# EAGLE design M7672n (EAGLE 4.11)
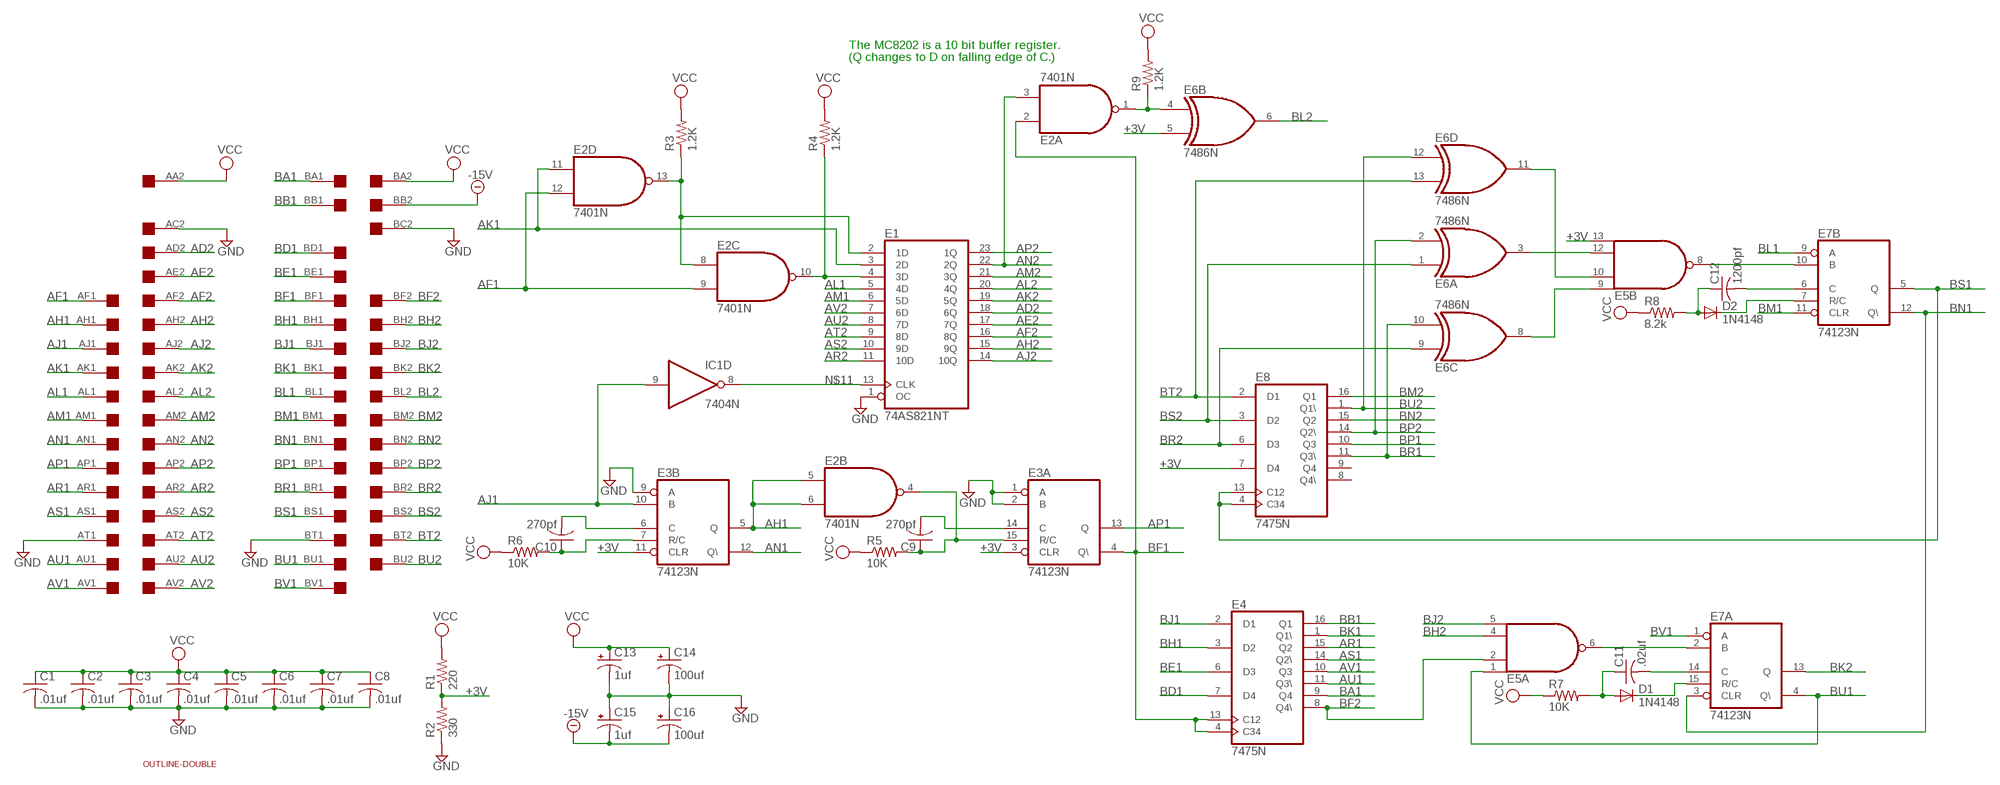
[diagram p0: schematic, sheet 1]

## Parts
C1  .01uf  C-US050-025X075  [C050-025X075]
C2  .01uf  C-US050-025X075  [C050-025X075]
C3  .01uf  C-US050-025X075  [C050-025X075]
C4  .01uf  C-US050-025X075  [C050-025X075]
C5  .01uf  C-US050-025X075  [C050-025X075]
C6  .01uf  C-US050-025X075  [C050-025X075]
C7  .01uf  C-US050-025X075  [C050-025X075]
C8  .01uf  C-US050-025X075  [C050-025X075]
C9  270pf  C-US050-025X075  [C050-025X075]
C10  270pf  C-US050-025X075  [C050-025X075]
C11  .02uf  C-US050-025X075  [C050-025X075]
C12  1200pf  C-US050-025X075  [C050-025X075]
C13  1uf  CPOL-USE30-10AXIAL  [E30-10]
C14  100uf  CPOL-USE30-10AXIAL  [E30-10]
C15  1uf  CPOL-USE30-10AXIAL  [E30-10]
C16  100uf  CPOL-USE30-10AXIAL  [E30-10]
D1  1N4148  [DO35-10]
D2  1N4148  [DO35-10]
E1  74AS821NT  [DIL24-6]
E2  7401N  [DIL14]
E3  74123N  [DIL16]
E4  7475N  [DIL16]
E5  74S20N  [DIL14]
E6  7486N  [DIL14]
E7  74123N  [DIL16]
E8  7475N  [DIL16]
EDGE  DOUBLE  [EDGE-CON4]
IC1  7404N  [DIL14]
R1  220  R-US_0207/10  [0207/10]
R2  330  R-US_0207/10  [0207/10]
R3  1.2K  R-US_0207/10  [0207/10]
R4  1.2K  R-US_0207/10  [0207/10]
R5  10K  R-US_0207/10  [0207/10]
R6  10K  R-US_0207/10  [0207/10]
R7  10K  R-US_0207/10  [0207/10]
R8  8.2k  R-US_0207/10  [0207/10]
R9  1.2K  R-US_0207/10  [0207/10]
U$2  OUTLINE-DOUBLE  [DOUBLE]

## Nets
+3V: E3.3(A:CLR) E3.11(B:CLR) E5.13(B:I3) E6.5(B:I1) E8.7(D4) R1.1 R2.2
-15V: C15.- C16.- EDGE.BB2
AD2: E1.18(6Q) EDGE.AD2
AE2: E1.17(7Q) EDGE.AE2
AF1: E2.9(C:I1) E2.12(D:I1) EDGE.AF1
AF2: E1.16(8Q) EDGE.AF2
AH1: E2.5(B:I0) E2.6(B:I1) E3.5(B:Q) EDGE.AH1
AH2: E1.15(9Q) EDGE.AH2
AJ1: E3.10(B:B) EDGE.AJ1 IC1.9(D:I)
AJ2: E1.14(10Q) EDGE.AJ2
AK1: E1.3(2D) E2.11(D:I0) EDGE.AK1
AK2: E1.19(5Q) EDGE.AK2
AL1: E1.5(4D) EDGE.AL1
AL2: E1.20(4Q) EDGE.AL2
AM1: E1.6(5D) EDGE.AM1
AM2: E1.21(3Q) EDGE.AM2
AN1: E3.12(B:Q\) EDGE.AN1
AN2: E1.22(2Q) E2.3(A:I1) EDGE.AN2
AP1: E3.13(A:Q) EDGE.AP1
AP2: E1.23(1Q) EDGE.AP2
AR1: E4.15(Q2) EDGE.AR1
AR2: E1.11(10D) EDGE.AR2
AS1: E4.14(Q2\) EDGE.AS1
AS2: E1.10(9D) EDGE.AS2
AT2: E1.9(8D) EDGE.AT2
AU1: E4.11(Q3\) EDGE.AU1
AU2: E1.8(7D) EDGE.AU2
AV1: E4.10(Q3) EDGE.AV1
AV2: E1.7(6D) EDGE.AV2
BA1: E4.9(Q4) EDGE.BA1
BB1: E4.16(Q1) EDGE.BB1
BD1: E4.7(D4) EDGE.BD1
BE1: E4.6(D3) EDGE.BE1
BF1: E2.2(A:I0) E3.4(A:Q\) E4.4(C34) E4.13(C12) EDGE.BF1
BF2: E4.8(Q4\) E5.2(A:I1) EDGE.BF2
BH1: E4.3(D2) EDGE.BH1
BH2: E5.4(A:I2) EDGE.BH2
BJ1: E4.2(D1) EDGE.BJ1
BJ2: E5.5(A:I3) EDGE.BJ2
BK1: E4.1(Q1\) EDGE.BK1
BK2: E7.13(A:Q) EDGE.BK2
BL1: E7.9(B:A) EDGE.BL1
BL2: E6.6(B:O) EDGE.BL2
BM1: E7.11(B:CLR) EDGE.BM1
BM2: E8.16(Q1) EDGE.BM2
BN1: E7.3(A:CLR) E7.12(B:Q\) EDGE.BN1
BN2: E8.15(Q2) EDGE.BN2
BP1: E8.10(Q3) EDGE.BP1
BP2: E6.2(A:I1) E8.14(Q2\) EDGE.BP2
BR1: E6.10(C:I1) E8.11(Q3\) EDGE.BR1
BR2: E6.9(C:I0) E8.6(D3) EDGE.BR2
BS1: E7.5(B:Q) E8.4(C34) E8.13(C12) EDGE.BS1
BS2: E6.1(A:I0) E8.3(D2) EDGE.BS2
BT2: E6.13(D:I1) E8.2(D1) EDGE.BT2
BU1: E5.1(A:I0) E7.4(A:Q\) EDGE.BU1
BU2: E6.12(D:I0) E8.1(Q1\) EDGE.BU2
BV1: E7.1(A:A) EDGE.BV1
GND [power]: C1.2 C2.2 C3.2 C4.2 C5.2 C6.2 C7.2 C8.2 C13.- C14.- C15.+ C16.+ E1.1(OC) E3.1(A:A) E3.2(A:B) E3.9(B:A) EDGE.AC2 EDGE.AT1 EDGE.BC2 EDGE.BT1 R2.1
N$1: E1.2(1D) E2.8(C:I0) E2.13(D:O) R3.1
N$2: E1.4(3D) E2.10(C:O) R4.1
N$3: E2.1(A:O) E6.4(B:I0) R9.1
N$4: E5.12(B:I2) E6.3(A:O)
N$5: C10.1 E3.7(B:R/C) R6.2
N$6: C10.2 E3.6(B:C)
N$7: C9.1 E2.4(B:O) E3.15(A:R/C) R5.2
N$8: C9.2 E3.14(A:C)
N$9: E5.10(B:I1) E6.11(D:O)
N$10: E5.9(B:I0) E6.8(C:O)
N$11: E1.13(CLK) IC1.8(D:O)
N$12: E5.6(A:O) E7.2(A:B)
N$13: D1.C E7.15(A:R/C)
N$14: C11.2 E7.14(A:C)
N$15: C11.1 D1.A R7.2
N$16: E5.8(B:O) E7.10(B:B)
N$17: D2.C E7.7(B:R/C)
N$18: C12.2 E7.6(B:C)
N$19: C12.1 D2.A R8.2
VCC [power]: C1.1 C2.1 C3.1 C4.1 C5.1 C6.1 C7.1 C8.1 C13.+ C14.+ EDGE.AA2 EDGE.BA2 R1.2 R3.2 R4.2 R5.1 R6.1 R7.1 R8.1 R9.2
Unconnected: E8.8(Q4\) E8.9(Q4) EDGE.AA1 EDGE.AB1 EDGE.AB2 EDGE.AC1 EDGE.AD1 EDGE.AE1 EDGE.BC1 EDGE.BD2 EDGE.BE2 EDGE.BV2 IC1.1(A:I) IC1.2(A:O) IC1.3(B:I) IC1.4(B:O) IC1.5(C:I) IC1.6(C:O) IC1.10(E:O) IC1.11(E:I) IC1.12(F:O) IC1.13(F:I)

## Notes on the sheet
- The MC8202 is a 10 bit buffer register.
- (Q changes to D on falling edge of C.)

## Power pins joined to a net without a drawn wire
GND: E1.12(GND) E2.7(P:GND) E3.8(P:GND) E4.12(GND) E5.7(P:GND) E6.7(P:GND) E7.8(P:GND) E8.12(GND) IC1.7(P:GND)
VCC: E1.24(VCC) E2.14(P:VCC) E3.16(P:VCC) E4.5(VCC) E5.14(P:VCC) E6.14(P:VCC) E7.16(P:VCC) E8.5(VCC) IC1.14(P:VCC)

## Library data of the parts
C1-C12 = rcl:C-US: CAPACITOR, American symbol
C13-C16 = rcl:CPOL-US: POLARIZED CAPACITOR, American symbol
D1 D2 = diode:1N4148: DIODE high speed (Philips)
E1 = 74xx-us:74*821: 10-bit bus interface FLIP FLOP
E2 = 74xx-jameco:74*01: Quad 2-input NAND gate, open collector
E3 E7 = 74xx-jameco:74*123: Retriggerable monostable MULTIVIBRATOR
E4 E8 = 74xx-jameco:74*75: 4-bit bistable LATCH
E5 = 74xx-jameco:74*20: Dual 4-input NAND gate
E6 = 74xx-jameco:74*86: Quad 2-input EXCLUSIV-OR (XOR) gate
EDGE = dec-con:DOUBLE: Double-Height DEC board
IC1 = 74xx-jameco:74*04: Hex INVERTER
R1-R9 = rcl:R-US_: RESISTOR, American symbol
U$2 = dec-con:OUTLINE-*: Board outlines for DEC boards.

## Net classes
1 power: width 0.508 mm

## Board
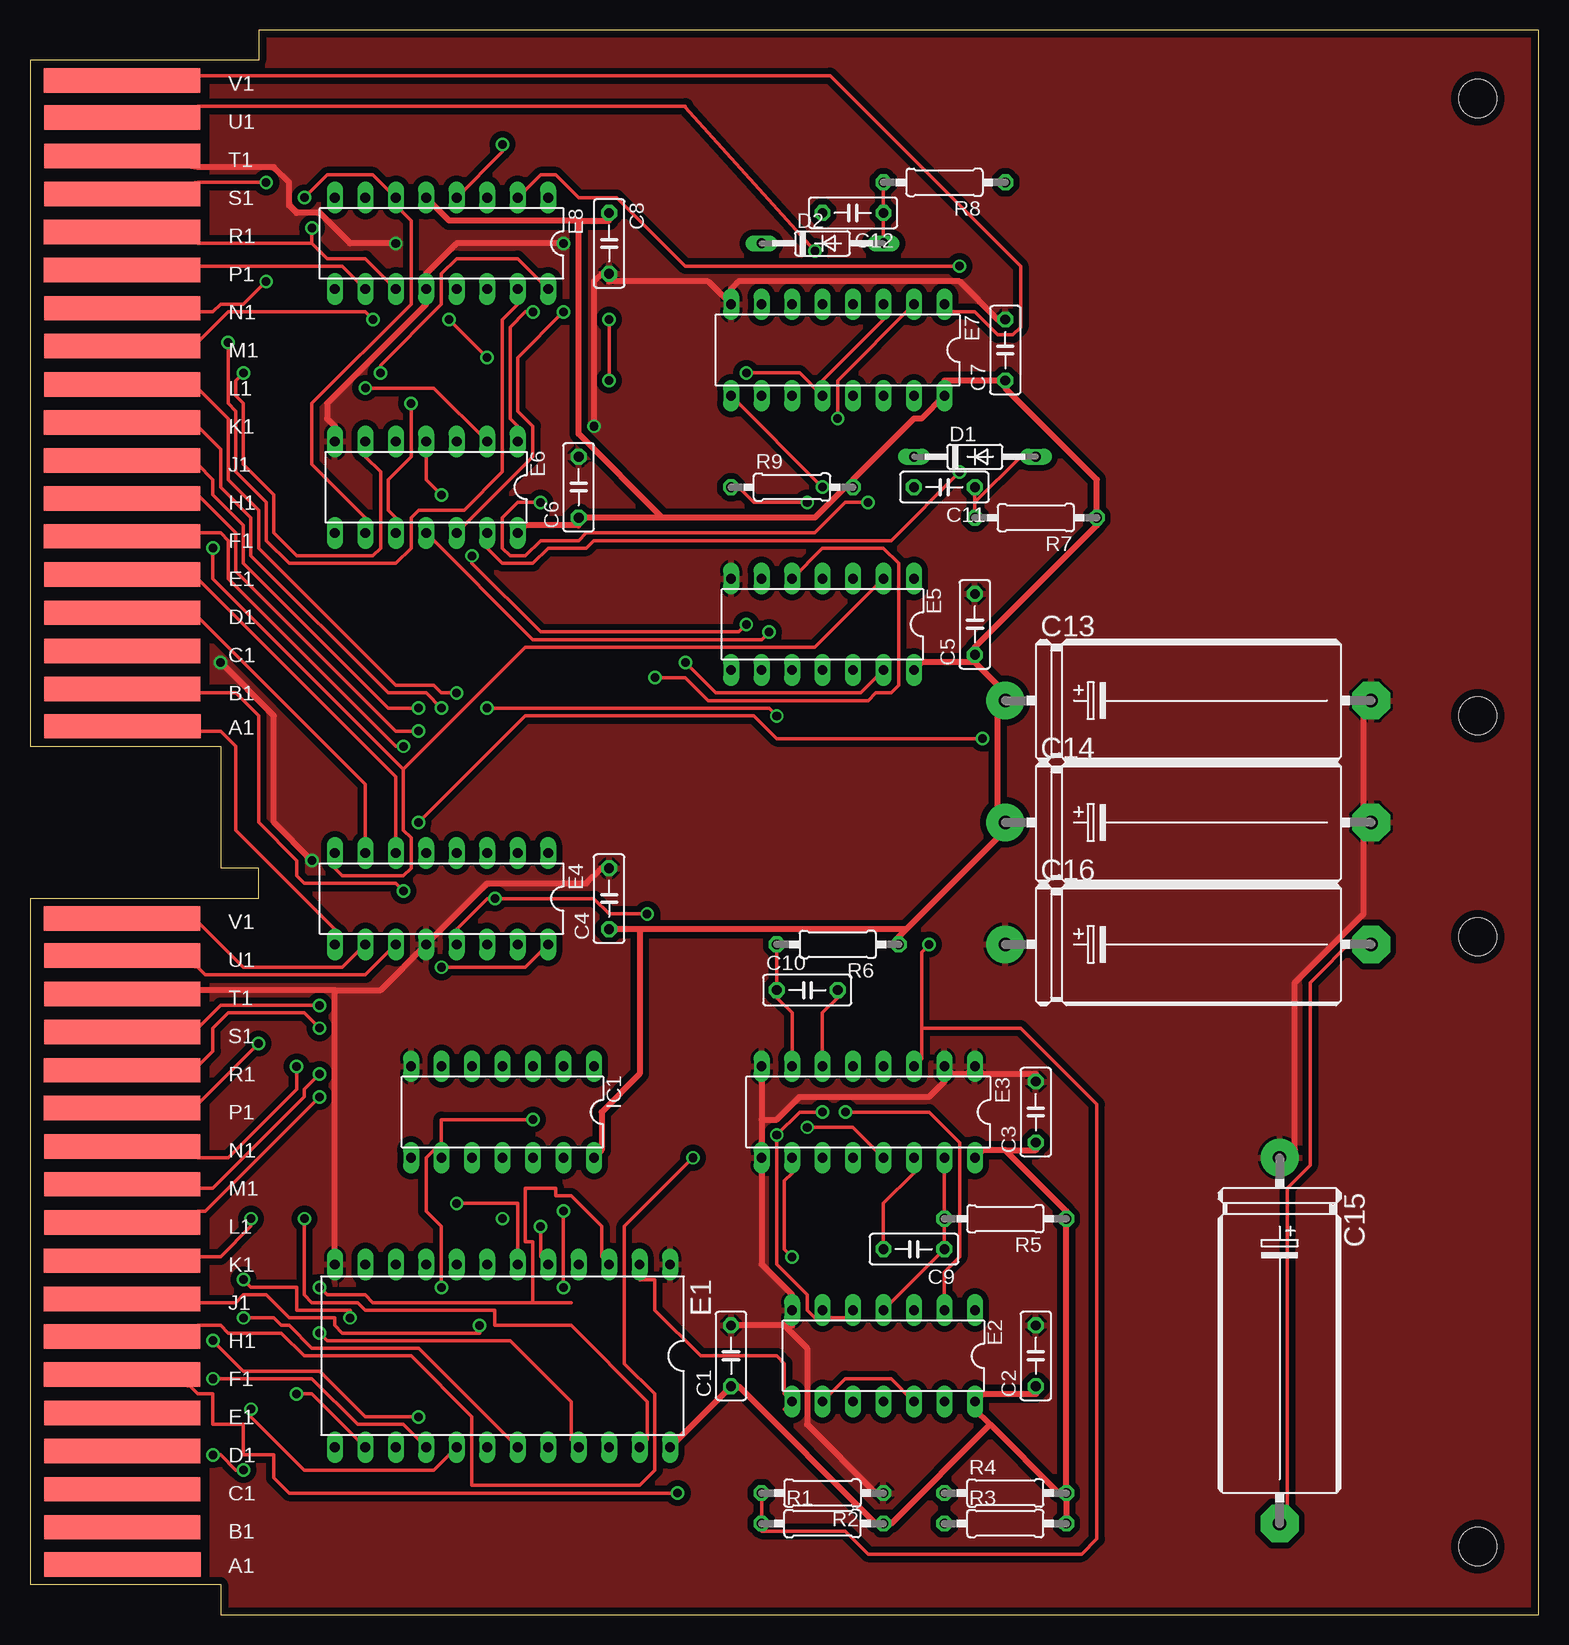
[diagram p1: board, top side]
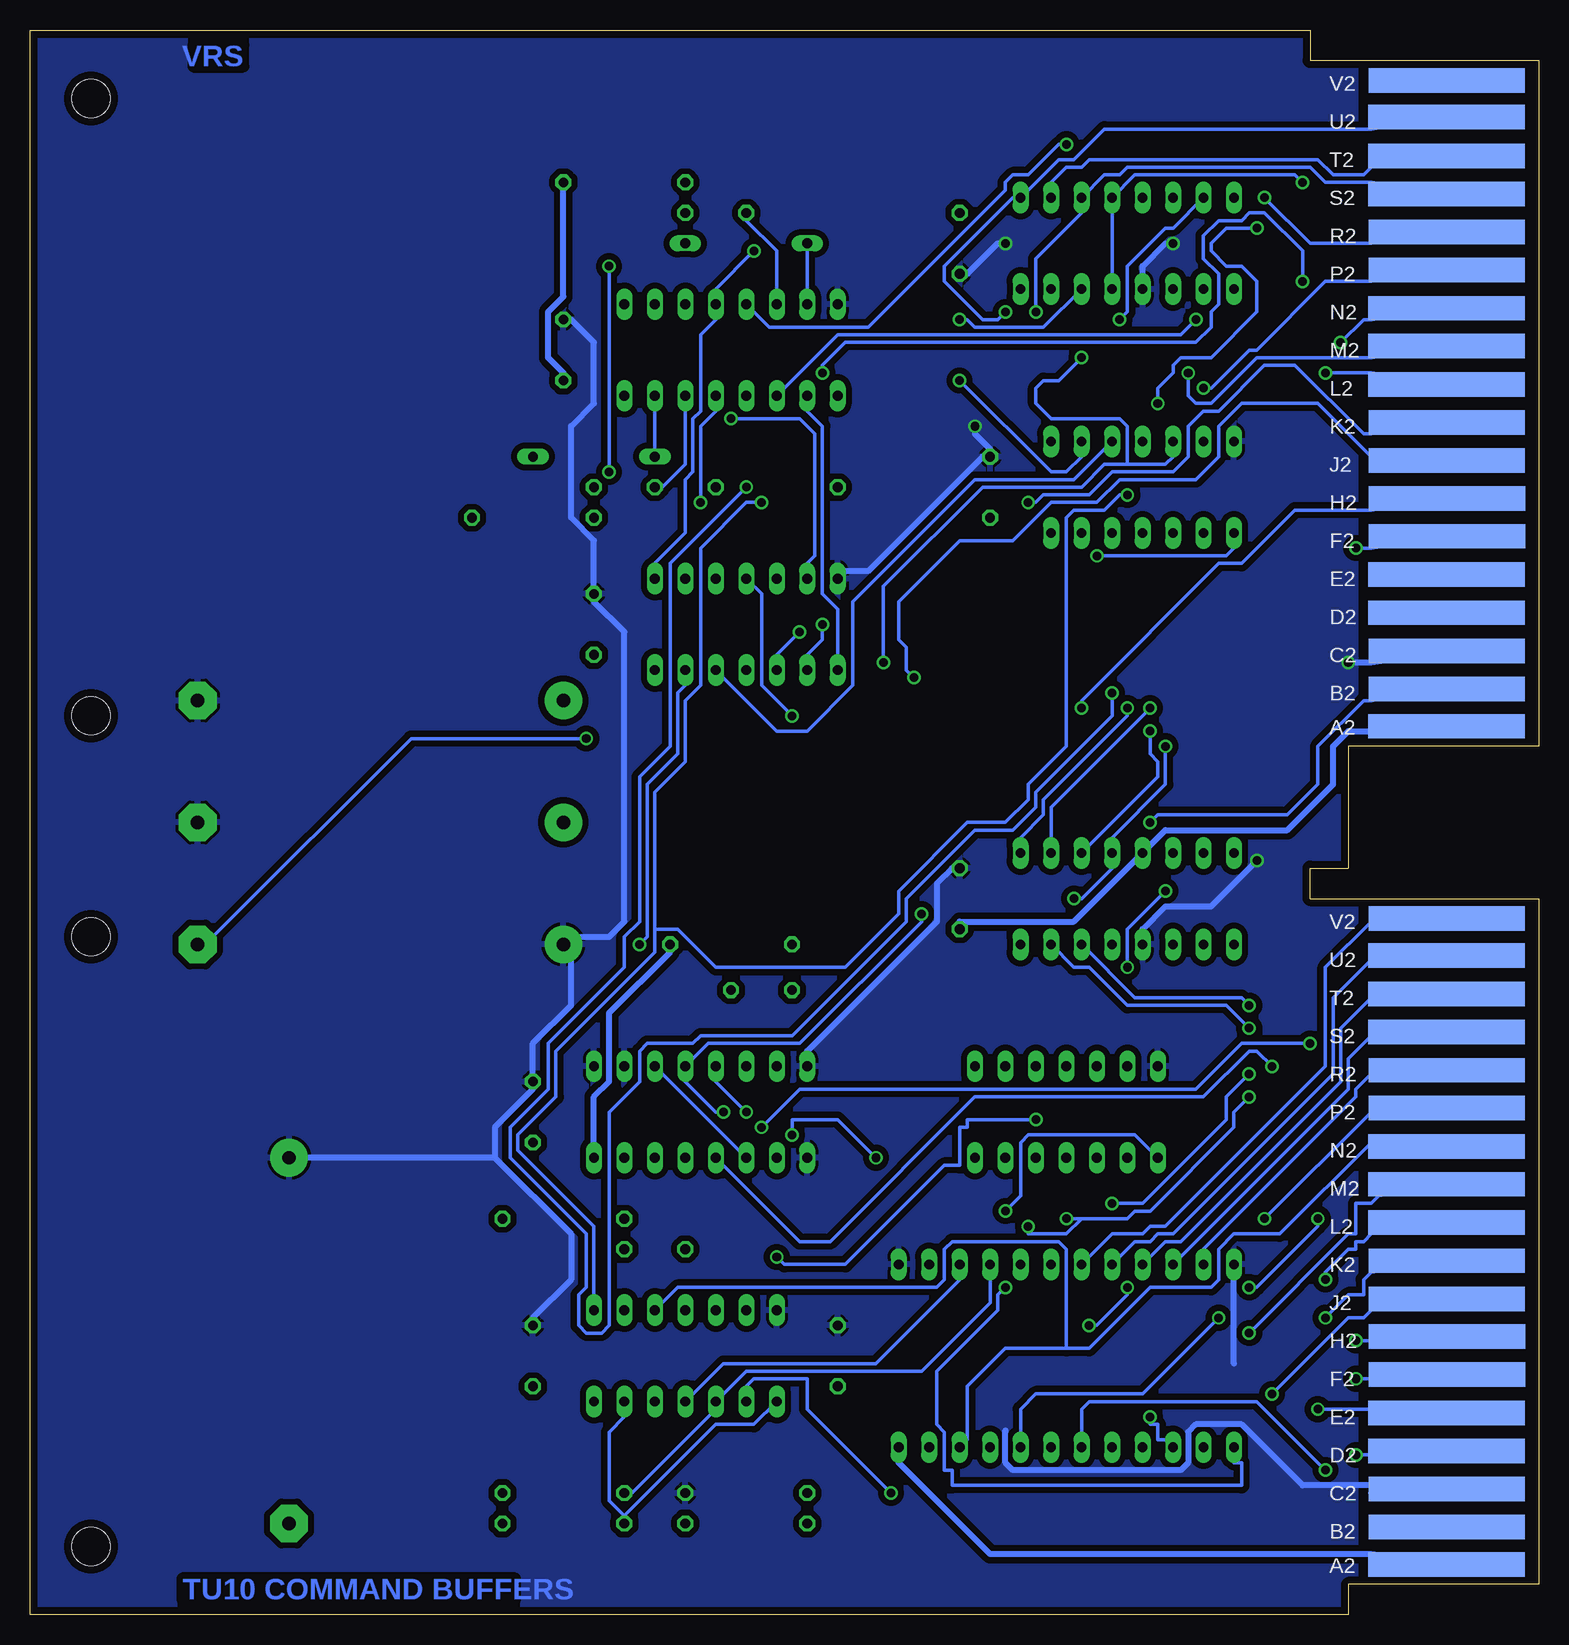
[diagram p2: board, bottom side, seen from below]

Size 125.73 x 132.08 mm. Coordinates in mm from the lower left corner, seen from the top.
Copper layers (1*16): Top 0.035mm / dielectric 1.5mm / Bottom 0.035mm
Design rules "10mils": minimum track width 12mil, minimum drill 28mil, track to track 10mil, track to pad 10mil, pad to pad 10mil, via to via 10mil, smd to smd 10mil, copper to edge 25mil, drill to drill 10mil, minimum pad ring 10mil, minimum via ring 8mil, stop-mask expansion 0mil, vias tented up to drill 0mil, thermal gap 10mil

### Footprints (pad centres in the part's own frame; a part is rotated, then mirrored left to right if it is on the bottom)
C050-025X075 = drill 0.813 octagon: 1 -2.54,0; 2 2.54,0
E30-10 = drill 1.118 pad 3.15 round: + -15.24,0 | drill 1.118 pad 3.15 octagon: - 15.24,0
DO35-10 = drill 0.813 long: A 5.08,0; C -5.08,0
DIL24-6 = drill 0.813 long: 1 -13.97,-7.62; 2 -11.43,-7.62; 3 -8.89,-7.62; 4 -6.35,-7.62; 5 -3.81,-7.62; 6 -1.27,-7.62; 7 1.27,-7.62; 8 3.81,-7.62; 9 6.35,-7.62; 10 8.89,-7.62; 11 11.43,-7.62; 12 13.97,-7.62; 13 13.97,7.62; 14 11.43,7.62; 15 8.89,7.62; 16 6.35,7.62; 17 3.81,7.62; 18 1.27,7.62; 19 -1.27,7.62; 20 -3.81,7.62; 21 -6.35,7.62; 22 -8.89,7.62; 23 -11.43,7.62; 24 -13.97,7.62
DIL14 = drill 0.813 long: 1 -7.62,-3.81; 2 -5.08,-3.81; 3 -2.54,-3.81; 4 0,-3.81; 5 2.54,-3.81; 6 5.08,-3.81; 7 7.62,-3.81; 8 7.62,3.81; 9 5.08,3.81; 10 2.54,3.81; 11 0,3.81; 12 -2.54,3.81; 13 -5.08,3.81; 14 -7.62,3.81
DIL16 = drill 0.813 long: 1 -8.89,-3.81; 2 -6.35,-3.81; 3 -3.81,-3.81; 4 -1.27,-3.81; 5 1.27,-3.81; 6 3.81,-3.81; 7 6.35,-3.81; 8 8.89,-3.81; 9 8.89,3.81; 10 6.35,3.81; 11 3.81,3.81; 12 1.27,3.81; 13 -1.27,3.81; 14 -3.81,3.81; 15 -6.35,3.81; 16 -8.89,3.81
EDGE-CON4 = smd 13.017 x 2.032: AA1 7.709,4.207; AB1 7.684,7.312; AC1 7.684,10.474; AD1 7.684,13.665; AE1 7.693,16.84; AF1 7.668,20.041; AH1 7.668,23.19; AJ1 7.668,26.34; AK1 7.668,29.515; AL1 7.693,32.69; AM1 7.693,35.89; AN1 7.693,39.04; AP1 7.668,42.24; AR1 7.668,45.39; AS1 7.693,48.565; AT1 7.693,51.74; AU1 7.693,54.94; AV1 7.668,58.026; BA1 7.709,74.057; BB1 7.684,77.162; BC1 7.684,80.324; BD1 7.684,83.515; BE1 7.693,86.69; BF1 7.668,89.891; BH1 7.668,93.04; BJ1 7.668,96.19; BK1 7.668,99.365; BL1 7.693,102.54; BM1 7.693,105.74; BN1 7.693,108.89; BP1 7.668,112.09; BR1 7.668,115.24; BS1 7.693,118.415; BT1 7.693,121.59; BU1 7.693,124.79; BV1 7.668,127.876 | smd 13.017 x 2.032 bottom: AA2 7.69,4.207; AB2 7.668,7.328; AC2 7.668,10.49; AD2 7.693,13.665; AE2 7.693,16.84; AF2 7.642,20.041; AH2 7.642,23.19; AJ2 7.668,26.34; AK2 7.668,29.515; AL2 7.693,32.69; AM2 7.693,35.89; AN2 7.693,39.04; AP2 7.668,42.24; AR2 7.668,45.39; AS2 7.693,48.565; AT2 7.693,51.74; AU2 7.693,54.966; AV2 7.668,58.026; BA2 7.69,74.057; BB2 7.668,77.178; BC2 7.668,80.34; BD2 7.693,83.515; BE2 7.693,86.69; BF2 7.642,89.891; BH2 7.642,93.04; BJ2 7.668,96.19; BK2 7.668,99.365; BL2 7.693,102.54; BM2 7.693,105.74; BN2 7.693,108.89; BP2 7.668,112.09; BR2 7.668,115.24; BS2 7.693,118.415; BT2 7.693,121.59; BU2 7.693,124.816; BV2 7.668,127.876
0207/10 = drill 0.813 octagon: 1 -5.08,0; 2 5.08,0
DOUBLE = hole 3.175: 120.65,56.515; 120.65,5.715; 120.65,74.93; 120.65,126.365

### Placement (x,y rotation side)
C1  58.42,21.59 90 top
C2  83.82,21.59 90 top
C3  83.82,41.91 90 top
C4  48.26,59.69 90 top
C5  78.74,82.55 90 top
C6  45.72,93.98 90 top
C7  81.28,105.41 90 top
C8  48.26,114.3 270 top
C9  73.66,30.48 180 top
C10  64.77,52.07 0 top
C11  76.2,93.98 180 top
C12  68.58,116.84 180 top
C13  96.52,76.2 0 top
C14  96.52,66.04 0 top
C15  104.14,22.86 270 top
C16  96.52,55.88 0 top
D1  78.74,96.52 0 top
D2  66.04,114.3 0 top
E1  39.37,21.59 180 top
E2  71.12,21.59 180 top
E3  69.85,41.91 180 top
E4  34.29,59.69 180 top
E5  66.04,82.55 180 top
E6  33.02,93.98 180 top
E7  67.31,105.41 180 top
E8  34.29,114.3 180 top
EDGE  0,0 0 top
IC1  39.37,41.91 180 top
R1  66.04,7.62 0 top
R2  66.04,10.16 180 top
R3  81.28,7.62 0 top
R4  81.28,10.16 0 top
R5  81.28,33.02 180 top
R6  67.31,55.88 180 top
R7  83.82,91.44 180 top
R8  76.2,119.38 180 top
R9  63.5,93.98 0 top
U$2  0,0 0 top

### Tracks (layer width: path | path; a pad name or v marks a point on that pad's centre or on a via)
+3V  (via drill 0.71)
  Top 0.305: R2.2 R1.1 60.96,6.99 67.95,6.99 69.85,5.08 87.63,5.08 88.9,6.35 88.9,42.55 82.55,48.9 74.3,48.9 | v74.93,55.88 74.3,55.24 74.3,48.9 | 74.3,48.9 74.3,46.35 E3.3 | v54.61,79.38 57.15,76.83 69.22,76.83 E5.13 | v38.1,104.78 v34.93,107.95
  Bottom 0.305: E3.3 E3.11 | v74.93,55.88 74.3,56.52 74.3,69.22 71.76,71.75 71.76,76.83 71.12,77.47 E5.13 | 34.29,95.89 36.2,95.89 38.1,93.98 46.36,93.98 54.61,85.72 v54.61,79.38 | 34.29,95.89 31.12,95.89 30.48,96.52 E6.5 | v34.93,107.95 34.29,108.58 34.29,112.39 31.12,115.57 30.48,115.57 E8.7 | v38.1,104.78 40.01,102.87 41.28,102.87 41.91,102.23 41.91,100.97 40.64,99.69 34.93,99.69 34.29,99.06 34.29,95.89
-15V  (via drill 0.71)
  Top 0.305: C15.- 104.78,8.89 104.78,35.56 106.68,37.47 106.68,52.7 110.49,56.52 C16.- | v32.39,66.04 41.28,74.93 60.33,74.93 62.23,73.03 v79.38,73.03
  Bottom 0.305: v32.39,66.04 31.75,66.67 20.96,66.67 18.42,69.22 18.42,72.39 14.61,76.2 13.97,76.2 EDGE.BB2 | v79.38,73.03 93.98,73.03 110.49,56.52 C16.-
AD2  (via drill 0.71)
  Top 0.305: v15.24,13.34 15.88,13.34 17.15,12.06 v17.78,12.06
  Bottom 0.305: v15.24,13.34 13.97,13.34 EDGE.AD2 | v17.78,12.06 23.5,17.78 37.47,17.78 38.1,17.14 E1.18
AE2  (via drill 0.71)
  Top 0.305: v18.42,17.14 18.42,16.51 22.86,12.06 33.66,12.06 E1.17
  Bottom 0.305: v18.42,17.14 13.97,17.14 EDGE.AE2
AF1  (via drill 0.71)
  Top 0.305: E2.9 67.95,19.68 71.76,19.68 E2.12 | v53.98,10.16 21.59,10.16 20.32,11.43 20.32,13.34 17.78,13.34 17.78,15.88 15.24,15.88 15.24,18.41 13.97,18.41 13.34,19.05 EDGE.AF1
  Bottom 0.305: v53.98,10.16 60.96,17.14 60.96,19.68 65.41,19.68 66.04,19.05 E2.9
AF2  (via drill 0.71)
  Top 0.305: E1.16 31.12,15.88 27.31,15.88 23.5,19.68 v15.24,19.68
  Bottom 0.305: v15.24,19.68 13.97,19.68 EDGE.AF2
AH1  (via drill 0.71)
  Top 0.305: E2.5 67.95,24.77 66.68,24.77 E2.6 65.41,24.77 64.77,25.4 64.77,26.67 62.23,29.21 v62.23,40.01 64.14,41.91 v66.04,41.91 | v55.25,38.1 49.53,32.38 49.53,20.95 52.07,18.41 52.07,12.06 50.8,10.79 36.83,10.79 36.83,16.51 31.75,21.59 22.86,21.59 20.96,23.5 16.51,23.5 15.88,24.13 13.97,24.13 EDGE.AH1
  Bottom 0.305: v66.04,41.91 68.58,44.45 E3.5 | v62.23,40.01 62.23,41.27 58.42,41.27 v55.25,38.1
AH2  (via drill 0.71)
  Top 0.305: v32.39,16.51 27.94,16.51 24.13,20.32 17.78,20.32 v15.24,22.86
  Bottom 0.305: v32.39,16.51 32.39,15.88 31.75,15.88 31.75,14.61 31.12,14.61 E1.15 | v15.24,22.86 13.97,22.86 EDGE.AH2
AJ1  (via drill 0.71)
  Top 0.305: v37.47,24.13 37.47,23.5 26.04,23.5 25.4,24.13 25.4,24.77 21.59,24.77 19.69,26.67 17.78,26.67 17.15,26.04 13.97,26.04 EDGE.AJ1 | v34.29,27.3 34.29,32.38 33.02,33.66 33.02,38.1 33.66,38.73 IC1.9 34.29,41.27 v41.91,41.27 | v63.5,29.84 62.87,30.48 62.87,36.2 63.5,36.83 E3.10
  Bottom 0.305: v37.47,24.13 36.83,24.13 34.29,26.67 v34.29,27.3 | v63.5,29.84 62.87,29.21 57.79,29.21 49.53,37.47 48.26,37.47 48.26,40.64 47.63,40.64 47.63,41.27 v41.91,41.27
AJ2  (via drill 0.71)
  Top 0.305: v22.23,18.41 23.5,18.41 E1.14
  Bottom 0.305: v22.23,18.41 15.88,24.77 14.61,24.77 13.97,25.4 EDGE.AJ2
AK1  (via drill 0.71)
  Top 0.305: v18.42,33.02 18.42,32.38 15.88,29.84 13.97,29.84 EDGE.AK1 | v24.13,27.3 24.77,26.67 27.94,26.67 28.58,26.04 41.91,26.04 | 41.91,26.04 45.09,26.04 | 41.91,26.04 41.91,31.11 41.28,31.11 41.28,35.56 43.82,35.56 43.82,34.92 45.09,34.92 47.63,32.38 47.63,29.84 E1.3
  Bottom 0.305: v18.42,33.02 18.42,32.38 23.5,27.3 v24.13,27.3 | E2.11 67.95,20.95 55.25,20.95 48.26,27.94 E1.3
AK2  (via drill 0.71)
  Top 0.305: v17.78,24.77 20.32,24.77 20.96,24.13 21.59,24.13 23.5,22.23 32.39,22.23 E1.19
  Bottom 0.305: v17.78,24.77 15.88,26.67 14.61,26.67 14.61,27.94 13.97,28.57 EDGE.AK2
AL1  (via drill 0.71)
  Top 0.305: v24.13,43.18 14.61,33.66 13.97,33.66 EDGE.AL1 | v42.55,32.38 42.55,29.84 E1.5
  Bottom 0.305: v24.13,43.18 25.4,41.91 25.4,40.64 32.39,33.66 33.66,33.66 34.29,33.02 38.1,33.02 | 38.1,33.02 v39.37,33.02 | v42.55,32.38 42.55,31.75 39.37,31.75 38.1,33.02
AL2  (via drill 0.71)
  Top 0.305: v17.78,27.94 18.42,27.3 22.23,27.3 22.23,25.4 26.67,25.4 v26.67,24.77
  Bottom 0.305: v17.78,27.94 17.78,28.57 15.88,30.48 15.24,30.48 15.24,31.11 14.61,31.11 13.97,31.75 EDGE.AL2 | v26.67,24.77 33.02,18.41 41.91,18.41 43.18,17.14 E1.20
AM1  (via drill 0.71)
  Top 0.305: v24.13,45.09 22.86,43.81 22.86,43.18 15.24,35.56 13.97,35.56 EDGE.AM1 | v35.56,34.29 40.64,34.29 E1.6
  Bottom 0.305: v24.13,45.09 26.04,43.18 26.04,41.27 33.02,34.29 v35.56,34.29
AM2  (via drill 0.71)
  Top 0.305: v24.13,23.5 24.77,22.86 40.01,22.86 45.09,17.78 45.09,14.61 E1.21
  Bottom 0.305: v24.13,23.5 15.88,31.75 15.24,31.75 15.24,34.29 13.97,34.29 13.34,34.92 EDGE.AM2
AN1  (via drill 0.71)
  Top 0.305: v22.23,45.72 22.23,43.81 16.51,38.1 13.97,38.1 EDGE.AN1
  Bottom 0.305: v22.23,45.72 23.5,46.99 24.13,46.99 27.94,43.18 46.99,43.18 59.06,31.11 61.6,31.11 E3.12
AN2
  Bottom 0.305: EDGE.AN2 13.97,39.37 21.59,31.75 25.4,31.75 26.67,30.48 26.67,27.94 27.31,27.3 32.39,27.3 37.47,22.23 39.37,22.23 | 39.37,22.23 39.37,30.48 40.01,31.11 48.9,31.11 49.53,30.48 49.53,27.94 50.17,27.3 71.76,27.3 E2.3 | E1.22 47.63,14.61 47.63,19.05 44.45,22.23 39.37,22.23
AP1  (via drill 0.71)
  Top 0.305: v64.77,40.64 68.58,40.64 E3.13 | v19.05,47.62 13.97,42.55 EDGE.AP1
  Bottom 0.305: v64.77,40.64 61.6,43.81 28.58,43.81 24.77,47.62 v19.05,47.62
AP2  (via drill 0.71)
  Top 0.305: v22.86,33.02 22.86,26.67 23.5,26.04 27.31,26.04 27.94,25.4 38.74,25.4 38.74,24.13 45.09,24.13 51.44,17.78 51.44,14.61 E1.23
  Bottom 0.305: v22.86,33.02 13.97,41.91 EDGE.AP2
AR1  (via drill 0.71)
  Top 0.305: v24.13,48.9 22.86,50.16 16.51,50.16 15.24,48.9 15.24,46.99 13.97,45.72 EDGE.AR1
  Bottom 0.305: v24.13,48.9 26.04,50.8 34.29,50.8 37.47,53.98 38.74,53.98 E4.15
AR2
  Bottom 0.305: EDGE.AR2 13.97,45.09 15.24,43.81 15.24,43.18 27.94,30.48 E1.11
AS1  (via drill 0.71)
  Top 0.305: v24.13,50.8 15.88,50.8 13.97,48.9 EDGE.AS1
  Bottom 0.305: v24.13,50.8 24.77,51.44 33.66,51.44 E4.14
AS2
  Bottom 0.305: EDGE.AS2 13.97,48.26 15.88,46.35 15.88,43.81 E1.10
AT2
  Bottom 0.305: EDGE.AT2 13.97,51.44 16.51,48.9 16.51,44.45 29.85,31.11 31.12,31.11 E1.9
AU1
  Top 0.305: E4.11 27.94,53.34 14.61,53.34 13.97,53.98 EDGE.AU1
AU2
  Bottom 0.305: EDGE.AU2 13.97,54.61 17.15,51.44 17.15,45.09 30.48,31.75 31.75,31.75 32.39,31.11 33.66,31.11 E1.8
AV1
  Top 0.305: E4.10 26.04,53.98 17.78,53.98 13.97,57.78 EDGE.AV1
AV2
  Bottom 0.305: EDGE.AV2 13.97,57.78 17.78,53.98 17.78,45.72 31.12,32.38 32.39,32.38 33.02,31.75 35.56,31.75 E1.7
BA1
  Top 0.305: E4.9 25.4,57.15 17.15,65.41 17.15,72.39 15.88,73.66 13.97,73.66 EDGE.BA1
BB1  (via drill 0.71)
  Top 0.305: v34.29,53.98 41.28,53.98 E4.16 | v31.12,60.33 30.48,60.96 22.86,60.96 22.23,61.59 22.23,62.87 19.05,66.04 19.05,74.93 17.15,76.83 13.97,76.83 EDGE.BB1
  Bottom 0.305: v34.29,53.98 34.29,57.15 v31.12,60.33
BD1
  Top 0.305: E4.7 27.94,69.22 13.97,83.19 EDGE.BD1
BE1
  Top 0.305: E4.6 30.48,69.85 13.97,86.36 EDGE.BE1
BF1  (via drill 0.71)
  Top 0.305: E4.13 35.56,57.15 38.1,59.69 v38.74,59.69 46.99,59.69 48.26,58.42 v51.44,58.42 | v67.95,41.91 74.93,41.91 77.47,39.37 77.47,29.84 76.2,28.57 E2.2 | v31.12,72.39 30.48,72.39 16.51,86.36 16.51,89.53 15.88,90.17 13.97,90.17 EDGE.BF1
  Bottom 0.305: v38.74,59.69 38.1,59.69 35.56,62.23 E4.4 35.56,64.77 31.12,69.22 v31.12,72.39 | v67.95,41.91 68.58,41.91 71.12,44.45 E3.4 69.22,47.62 61.6,47.62 51.44,57.78 v51.44,58.42
BF2  (via drill 0.71)
  Top 0.305: v15.24,88.9 15.24,86.36 31.12,70.48 | 31.12,70.48 31.12,65.41 31.75,64.77 31.75,62.23 31.12,61.59 26.04,61.59 25.4,62.23 E4.8 | 31.12,70.48 41.28,80.64 65.41,80.64 E5.2
  Bottom 0.305: v15.24,88.9 13.97,88.9 EDGE.BF2
BH1  (via drill 0.71)
  Top 0.305: v32.39,73.66 30.48,73.66 17.15,87 17.15,90.17 13.97,93.34 EDGE.BH1
  Bottom 0.305: v32.39,73.66 32.39,71.75 31.75,71.12 31.75,69.85 E4.3
BH2  (via drill 0.71)
  Top 0.305: v38.1,75.56 61.6,75.56 v62.23,74.93
  Bottom 0.305: v38.1,75.56 38.1,76.2 26.67,87.63 24.77,87.63 20.32,92.08 13.97,92.08 EDGE.BH2 | v62.23,74.93 64.77,77.47 64.77,85.09 E5.4
BJ1  (via drill 0.71)
  Top 0.305: v32.39,75.56 29.85,75.56 17.78,87.63 17.78,90.81 15.24,93.34 15.24,94.61 13.97,95.89 EDGE.BJ1
  Bottom 0.305: v32.39,75.56 40.64,67.31 E4.2
BJ2  (via drill 0.71)
  Top 0.305: v52.07,78.11 54.61,78.11 56.52,76.2 69.85,76.2 70.49,76.83 71.76,76.83 72.39,77.47 72.39,87.63 71.12,88.9 66.04,88.9 E5.5
  Bottom 0.305: v52.07,78.11 52.71,78.74 52.71,80.64 53.34,81.28 53.34,84.45 48.26,89.53 43.82,89.53 40.64,92.71 36.83,92.71 34.93,94.61 28.58,94.61 26.67,96.52 26.67,99.06 24.77,100.97 18.42,100.97 13.97,96.52 EDGE.BJ2
BK1  (via drill 0.71)
  Top 0.305: v34.29,75.56 33.02,76.83 29.85,76.83 18.42,88.27 18.42,91.44 15.88,93.98 15.88,97.16 13.97,99.06 EDGE.BK1
  Bottom 0.305: v34.29,75.56 34.29,74.93 41.28,67.94 41.28,66.67 43.18,64.77 E4.1
BK2  (via drill 0.71)
  Top 0.305: v69.85,92.71 67.95,92.71 65.41,90.17 46.36,90.17 45.72,89.53 42.55,89.53 41.28,88.27 40.01,88.27 39.37,88.9 39.37,91.44 40.64,92.71 v42.55,92.71
  Bottom 0.305: v69.85,92.71 69.85,99.06 68.58,100.33 E7.13 | v42.55,92.71 41.91,92.71 41.28,93.34 37.47,93.34 35.56,95.25 30.48,95.25 29.21,96.52 29.21,99.06 27.94,100.33 26.67,100.33 22.86,104.14 20.32,104.14 14.61,98.42 13.97,98.42 EDGE.BK2
BL1  (via drill 0.71)
  Top 0.305: v35.56,76.83 34.29,76.83 33.66,77.47 30.48,77.47 19.05,88.9 19.05,92.08 16.51,94.61 16.51,99.69 13.97,102.23 EDGE.BL1 | v66.04,93.98 E7.9
  Bottom 0.305: v66.04,93.98 72.39,87.63 72.39,72.39 74.93,69.85 74.93,57.78 76.2,56.52 76.2,53.98 82.55,47.62 82.55,43.81 85.73,40.64 85.73,38.1 79.38,31.75 79.38,27.3 80.01,26.67 80.01,24.13 79.38,23.5 78.11,23.5 77.47,24.13 77.47,41.91 74.93,44.45 74.93,46.99 74.3,47.62 70.49,47.62 69.85,48.26 62.23,48.26 52.71,57.78 52.71,59.69 46.99,65.41 43.82,65.41 41.91,67.31 41.91,68.58 35.56,74.93 v35.56,76.83
BL2  (via drill 0.71)
  Top 0.305: v17.78,103.5 17.15,102.87 17.15,101.6 17.78,100.97 17.78,95.89 20.32,93.34 20.32,90.17 22.23,88.27 28.58,88.27 29.21,88.9 29.21,95.25 27.94,96.52 E6.6
  Bottom 0.305: v17.78,103.5 13.97,103.5 EDGE.BL2
BM1  (via drill 0.71)
  Top 0.305: v28.58,107.95 27.94,108.58 16.51,108.58 13.97,106.05 EDGE.BM1
  Bottom 0.305: v28.58,107.95 29.85,106.68 58.42,106.68 E7.11
BM2  (via drill 0.71)
  Top 0.305: v29.21,103.5 29.21,104.14 34.29,109.22 34.29,111.76 35.56,113.03 40.64,113.03 E8.16
  Bottom 0.305: v29.21,103.5 29.21,101.6 28.58,100.97 27.31,100.97 23.5,104.78 13.97,104.78 EDGE.BM2
BN1  (via drill 0.71)
  Top 0.305: v19.69,111.12 17.78,109.22 15.88,109.22 15.24,108.58 13.97,108.58 EDGE.BN1 | v59.69,103.5 64.14,103.5 E7.12 66.04,102.87 71.12,107.95 E7.3
  Bottom 0.305: v19.69,111.12 19.69,113.67 22.86,116.84 24.13,116.84 24.77,116.2 26.67,116.2 27.94,114.94 27.94,113.03 26.67,111.76 26.67,109.22 27.31,108.58 27.31,107.31 28.58,106.05 57.79,106.05 59.69,104.14 v59.69,103.5
BN2  (via drill 0.71)
  Top 0.305: v16.51,106.05 16.51,100.97 17.15,100.33 17.15,95.25 19.69,92.71 19.69,89.53 21.59,87.63 30.48,87.63 31.75,88.9 31.75,91.44 32.39,92.08 36.2,92.08 39.37,95.25 39.37,107.95 40.64,109.22 E8.15
  Bottom 0.305: v16.51,106.05 14.61,107.95 13.97,107.95 EDGE.BN2
BP1
  Top 0.305: E8.10 26.04,112.39 13.97,112.39 EDGE.BP1
BP2  (via drill 0.71)
  Top 0.305: v27.94,102.23 33.66,102.23 E6.2 | v48.26,102.87 v48.26,107.95
  Bottom 0.305: v27.94,102.23 27.31,102.23 24.13,105.41 23.5,105.41 17.78,111.12 13.97,111.12 EDGE.BP2 | v48.26,107.95 47.63,107.95 46.99,107.31 41.28,107.31 E8.14 | v48.26,102.87 40.64,95.25 39.37,95.25 38.1,96.52 E6.2
BR1  (via drill 0.71)
  Top 0.305: 23.5,114.3 13.97,114.3 EDGE.BR1 | 23.5,114.3 24.77,113.03 27.94,113.03 E8.11 | v31.75,100.97 31.75,96.52 29.85,94.61 29.85,92.08 30.48,91.44 E6.10 | v23.5,115.57 23.5,114.3
  Bottom 0.305: v31.75,100.97 31.75,102.23 30.48,103.5 30.48,104.14 29.85,104.78 27.31,104.78 23.5,108.58 23.5,111.12 24.77,112.39 26.04,112.39 27.31,113.67 27.31,114.3 26.04,115.57 v23.5,115.57
BR2  (via drill 0.71)
  Top 0.305: v22.86,118.11 24.77,120.02 28.58,120.02 E8.6 30.48,117.47 31.75,116.2 31.75,109.22 23.5,100.97 23.5,95.89 27.94,91.44 E6.9
  Bottom 0.305: v22.86,118.11 19.05,114.3 13.97,114.3 EDGE.BR2
BS1  (via drill 0.71)
  Top 0.305: v19.69,119.38 13.97,119.38 EDGE.BS1 | v39.37,122.56 39.37,121.92 E8.4
  Bottom 0.305: v19.69,119.38 20.32,120.02 33.66,120.02 E8.4 E8.13 | v39.37,122.56 40.01,122.56 42.55,120.02 43.82,120.02 44.45,119.38 44.45,118.75 55.88,107.31 64.14,107.31 E7.5
BS2  (via drill 0.71)
  Top 0.305: v41.91,108.58 41.28,108.58 40.01,107.31 40.01,99.69 40.64,99.06 E6.1
  Bottom 0.305: EDGE.BS2 13.97,119.38 17.78,119.38 19.05,120.65 34.29,120.65 34.93,120.02 36.2,120.02 E8.3 38.1,116.84 41.91,113.03 v41.91,108.58
BT2  (via drill 0.71)
  Top 0.305: v77.47,95.25 71.76,89.53 46.99,89.53 46.36,88.9 43.18,88.9 41.91,87.63 39.37,87.63 38.1,88.9 E6.13 | v77.47,112.39 54.61,112.39 48.9,118.11 45.72,118.11 43.82,120.02 42.55,120.02 E8.2
  Bottom 0.305: EDGE.BT2 13.97,120.65 14.61,120.02 17.15,120.02 18.42,121.28 37.47,121.28 38.1,120.65 39.37,120.65 40.64,119.38 E8.2 | v77.47,95.25 v77.47,112.39
BU1  (via drill 0.71)
  Top 0.305: v65.41,113.67 54.58,125.7 54.61,125.73 13.97,125.73 EDGE.BU1
  Bottom 0.305: E5.1 73.66,87.63 71.12,90.17 71.12,94.61 70.49,95.25 70.49,99.69 69.85,100.33 69.85,106.68 68.58,107.95 E7.4 68.58,110.49 v65.41,113.67
BU2  (via drill 0.71)
  Top 0.305: v44.45,108.58 40.64,104.78 40.64,100.33 41.91,99.06 41.91,96.52 E6.12
  Bottom 0.305: EDGE.BU2 13.97,123.83 36.2,123.83 38.74,121.28 40.01,121.28 E8.1 43.82,118.11 49.53,112.39 49.53,111.12 46.36,107.95 45.09,107.95 v44.45,108.58
BV1
  Top 0.305: E7.1 76.84,108.58 78.74,108.58 80.65,106.68 81.92,106.68 82.55,107.31 82.55,112.39 66.68,128.27 13.97,128.27 EDGE.BV1
GND  (via drill 0.71)
  Top 0.508: v46.99,99.06 46.99,111.12 47.63,111.76 C8.2 48.26,111.12 56.52,111.12 E7.8 58.42,110.49 59.06,111.12 77.47,111.12 80.65,107.95 C7.2 | v30.48,114.3 26.67,114.3 24.13,116.84 22.23,116.84 21.59,117.47 21.59,119.38 20.32,120.65 13.97,120.65 EDGE.BT1 | E6.7 25.4,99.06 24.77,99.69 24.77,100.97 33.02,109.22 E8.12 33.02,111.76 35.56,114.3 v44.45,114.3 | 60.96,41.27 E3.9 60.96,29.21 63.5,26.67 E2.7 63.5,24.13 62.87,24.13 | E3.8 60.96,41.27 | 62.87,24.13 C1.2 | 62.87,24.13 64.77,22.23 64.77,15.88 70.49,10.16 R2.1 | C13.- 111.13,74.93 111.13,67.31 C14.- 111.13,64.77 111.13,58.42 105.41,52.7 105.41,38.73 C15.+ | C3.2 83.82,45.09 79.38,45.09 E3.1 78.11,45.09 76.84,45.09 E3.2 76.2,44.45 74.93,43.18 64.14,43.18 62.23,41.27 60.96,41.27 | 25.4,52.07 13.97,52.07 EDGE.AT1 | 25.4,52.07 29.21,52.07 E4.12 38.1,60.96 46.36,60.96 47.63,62.23 C4.2 | v15.88,79.38 20.32,74.93 20.32,66.04 v23.5,62.87 | E1.12 25.4,52.07
  Bottom 0.508: C7.2 80.65,107.95 78.74,106.05 78.74,100.97 80.65,99.06 80.65,91.44 78.74,89.53 C5.2 78.74,84.45 76.2,81.92 76.2,57.78 77.47,56.52 80.01,56.52 C16.+ 80.65,54.61 80.65,50.8 83.82,47.62 C3.2 83.82,43.81 87,40.64 87,38.1 | v46.99,99.06 46.99,98.42 45.72,97.16 C6.2 46.36,96.52 55.88,87 57.79,87 E5.7 | v30.48,114.3 31.12,114.3 33.02,112.39 E8.12 | v44.45,114.3 45.09,114.3 47.63,111.76 C8.2 | 87,38.1 80.65,31.75 80.65,27.94 83.82,24.77 C2.2 | 87,38.1 C15.+ | 25.4,20.95 E1.12 | 13.97,10.16 EDGE.AC2 13.97,10.79 19.69,10.79 24.77,15.88 28.58,15.88 29.21,15.24 29.21,12.7 29.85,12.06 43.82,12.06 44.45,12.7 44.45,15.24 44.45,15.37 | v15.88,79.38 13.97,79.38 EDGE.BC2 | v23.5,62.87 27.31,59.05 31.12,59.05 33.02,57.15 E4.12 | E3.8 60.96,46.99 50.17,57.78 50.17,60.96 48.9,62.23 C4.2
  pour Bottom (isolate 0.508): 125.73,0 15.24,0 15.24,132.08 125.73,132.08
  pour Top (isolate 0.508): 125.73,0 15.24,0 15.24,132.08 125.73,132.08
N$1
  Top 0.305: 62.87,17.14 E2.8 62.87,18.41 62.87,20.95 62.23,21.59 55.88,21.59 52.07,25.4 52.07,27.94 50.8,27.94 E1.2
  Bottom 0.305: 76.2,8.26 77.47,9.53 77.47,15.24 76.2,16.51 E2.13 | 76.2,8.26 68.58,15.88 65.41,15.88 E2.8 | 76.2,8.26 R3.1
N$2
  Bottom 0.305: R4.1 75.57,10.16 68.58,17.14 E2.10 66.04,20.32 51.44,20.32 45.72,26.04 E1.4
N$3  (via drill 0.71)
  Top 0.305: v64.77,92.71 60.33,92.71 59.06,93.98 R9.1 | v34.29,93.34 33.02,94.61 E6.4
  Bottom 0.305: v64.77,92.71 66.04,92.71 69.85,88.9 69.85,77.47 71.12,76.2 71.12,71.12 73.66,68.58 73.66,57.15 | 73.66,57.15 73.66,55.24 81.92,46.99 81.92,43.18 85.09,40.01 85.09,38.73 78.74,32.38 E2.1 | v34.29,93.34 34.93,93.34 36.2,92.08 38.74,92.08 39.37,91.44 39.37,72.39 42.55,69.22 42.55,67.94 44.45,66.04 47.63,66.04 53.34,60.33 53.34,58.42 57.79,53.98 68.58,53.98 71.76,57.15 73.66,57.15
N$4
  Bottom 0.305: E6.3 38.74,94.61 46.99,94.61 57.15,84.45 57.15,77.47 60.96,73.66 63.5,73.66 E5.12
N$5
  Top 0.305: E3.7 63.5,50.16 62.23,51.44 C10.1 R6.2
N$6
  Top 0.305: E3.6 66.04,50.16 67.31,51.44 C10.2
N$7
  Top 0.305: E2.4 C9.1 R5.2 E3.15
N$8
  Top 0.305: C9.2 71.12,34.29 73.66,36.83 E3.14
N$9  (via drill 0.71)
  Top 0.305: v61.6,81.92 60.96,81.28 41.91,81.28 E6.11
  Bottom 0.305: v61.6,81.92 63.5,80.01 E5.10
N$10  (via drill 0.71)
  Top 0.305: v59.69,82.55 59.06,81.92 42.55,81.92 36.83,87.63 v36.83,88.27
  Bottom 0.305: v59.69,82.55 59.69,81.28 60.96,80.01 E5.9 | v36.83,88.27 26.04,88.27 25.4,88.9 E6.8
N$11  (via drill 0.71)
  Top 0.305: v44.45,27.3 v44.45,33.66
  Bottom 0.305: v44.45,27.3 45.09,26.67 45.09,25.4 50.17,20.32 50.17,15.88 49.53,15.24 49.53,12.06 48.9,12.06 48.9,10.79 24.77,10.79 24.77,12.7 25.4,12.7 E1.13 | v44.45,33.66 43.18,34.92 43.18,39.37 42.55,40.01 33.66,40.01 IC1.8
N$12  (via drill 0.71)
  Top 0.305: v67.31,99.69 67.31,102.87 E7.2
  Bottom 0.305: v67.31,99.69 61.6,99.69 60.33,98.42 60.33,88.27 60.96,87.63 E5.6
N$13
  Bottom 0.305: D1.C E7.15
N$14
  Bottom 0.305: C11.2 73.03,93.98 71.12,95.89 E7.14
N$15
  Top 0.305: R7.2 78.74,92.71 | 78.74,92.71 C11.1 | 78.74,92.71 82.55,96.52 D1.A
N$16
  Bottom 0.305: E5.8 58.42,83.82 59.69,85.09 59.69,99.06 60.96,100.33 E7.10
N$17
  Bottom 0.305: E7.7 D2.C
N$18
  Bottom 0.305: E7.6 63.5,113.67 66.04,116.2 C12.2
N$19
  Top 0.305: D2.A C12.1 R8.2
VCC
  Top 0.508: E1.24 C1.1 59.06,19.05 70.49,7.62 R1.2 71.76,7.62 80.01,15.88 | 81.28,38.73 83.82,38.73 C3.1 | 81.28,38.73 79.38,38.73 E3.16 | 81.28,38.73 86.36,33.66 R5.1 R4.2 | R4.2 R3.2 | C2.1 83.82,18.41 79.38,18.41 E2.14 78.74,17.14 80.01,15.88 | 80.01,15.88 85.73,10.16 R4.2 | 45.72,116.2 48.26,116.2 C8.1 | 45.72,116.2 34.93,116.2 E8.5 | E6.14 41.28,90.81 45.72,90.81 C6.1 52.71,91.44 | 52.71,91.44 65.41,91.44 67.95,93.98 R9.2 68.58,94.61 73.66,99.69 74.3,99.69 E7.16 76.2,102.87 C7.1 81.28,102.23 88.9,94.61 R7.1 88.9,90.81 78.74,80.64 C5.1 78.74,79.38 | 45.72,116.2 45.72,98.42 52.71,91.44 | 78.74,79.38 74.3,79.38 E5.14 | 78.74,79.38 80.65,77.47 C13.+ 80.65,74.93 80.65,67.31 C14.+ 80.65,64.77 73.03,57.15 | 73.03,57.15 72.39,56.52 R6.1 | 73.03,57.15 50.8,57.15 | 50.8,57.15 C4.1 | 50.8,57.15 50.8,45.09 47.63,41.91 47.63,38.73 IC1.14
  Bottom 0.508: EDGE.AA2 13.97,5.08 45.72,5.08 53.34,12.7 E1.24 | R8.1 81.28,109.86 82.55,108.58 82.55,104.78 81.28,103.5 C7.1 | C4.1 48.26,57.78 38.74,57.78 E4.5 31.12,65.41 20.96,65.41 17.15,69.22 17.15,72.39 15.88,73.66 13.97,73.66 EDGE.BA2 | E3.16 78.74,43.18 77.47,44.45 77.47,50.16 72.39,55.24 R6.1

### Text on the board
Bottom: VRS | TU10 COMMAND BUFFERS